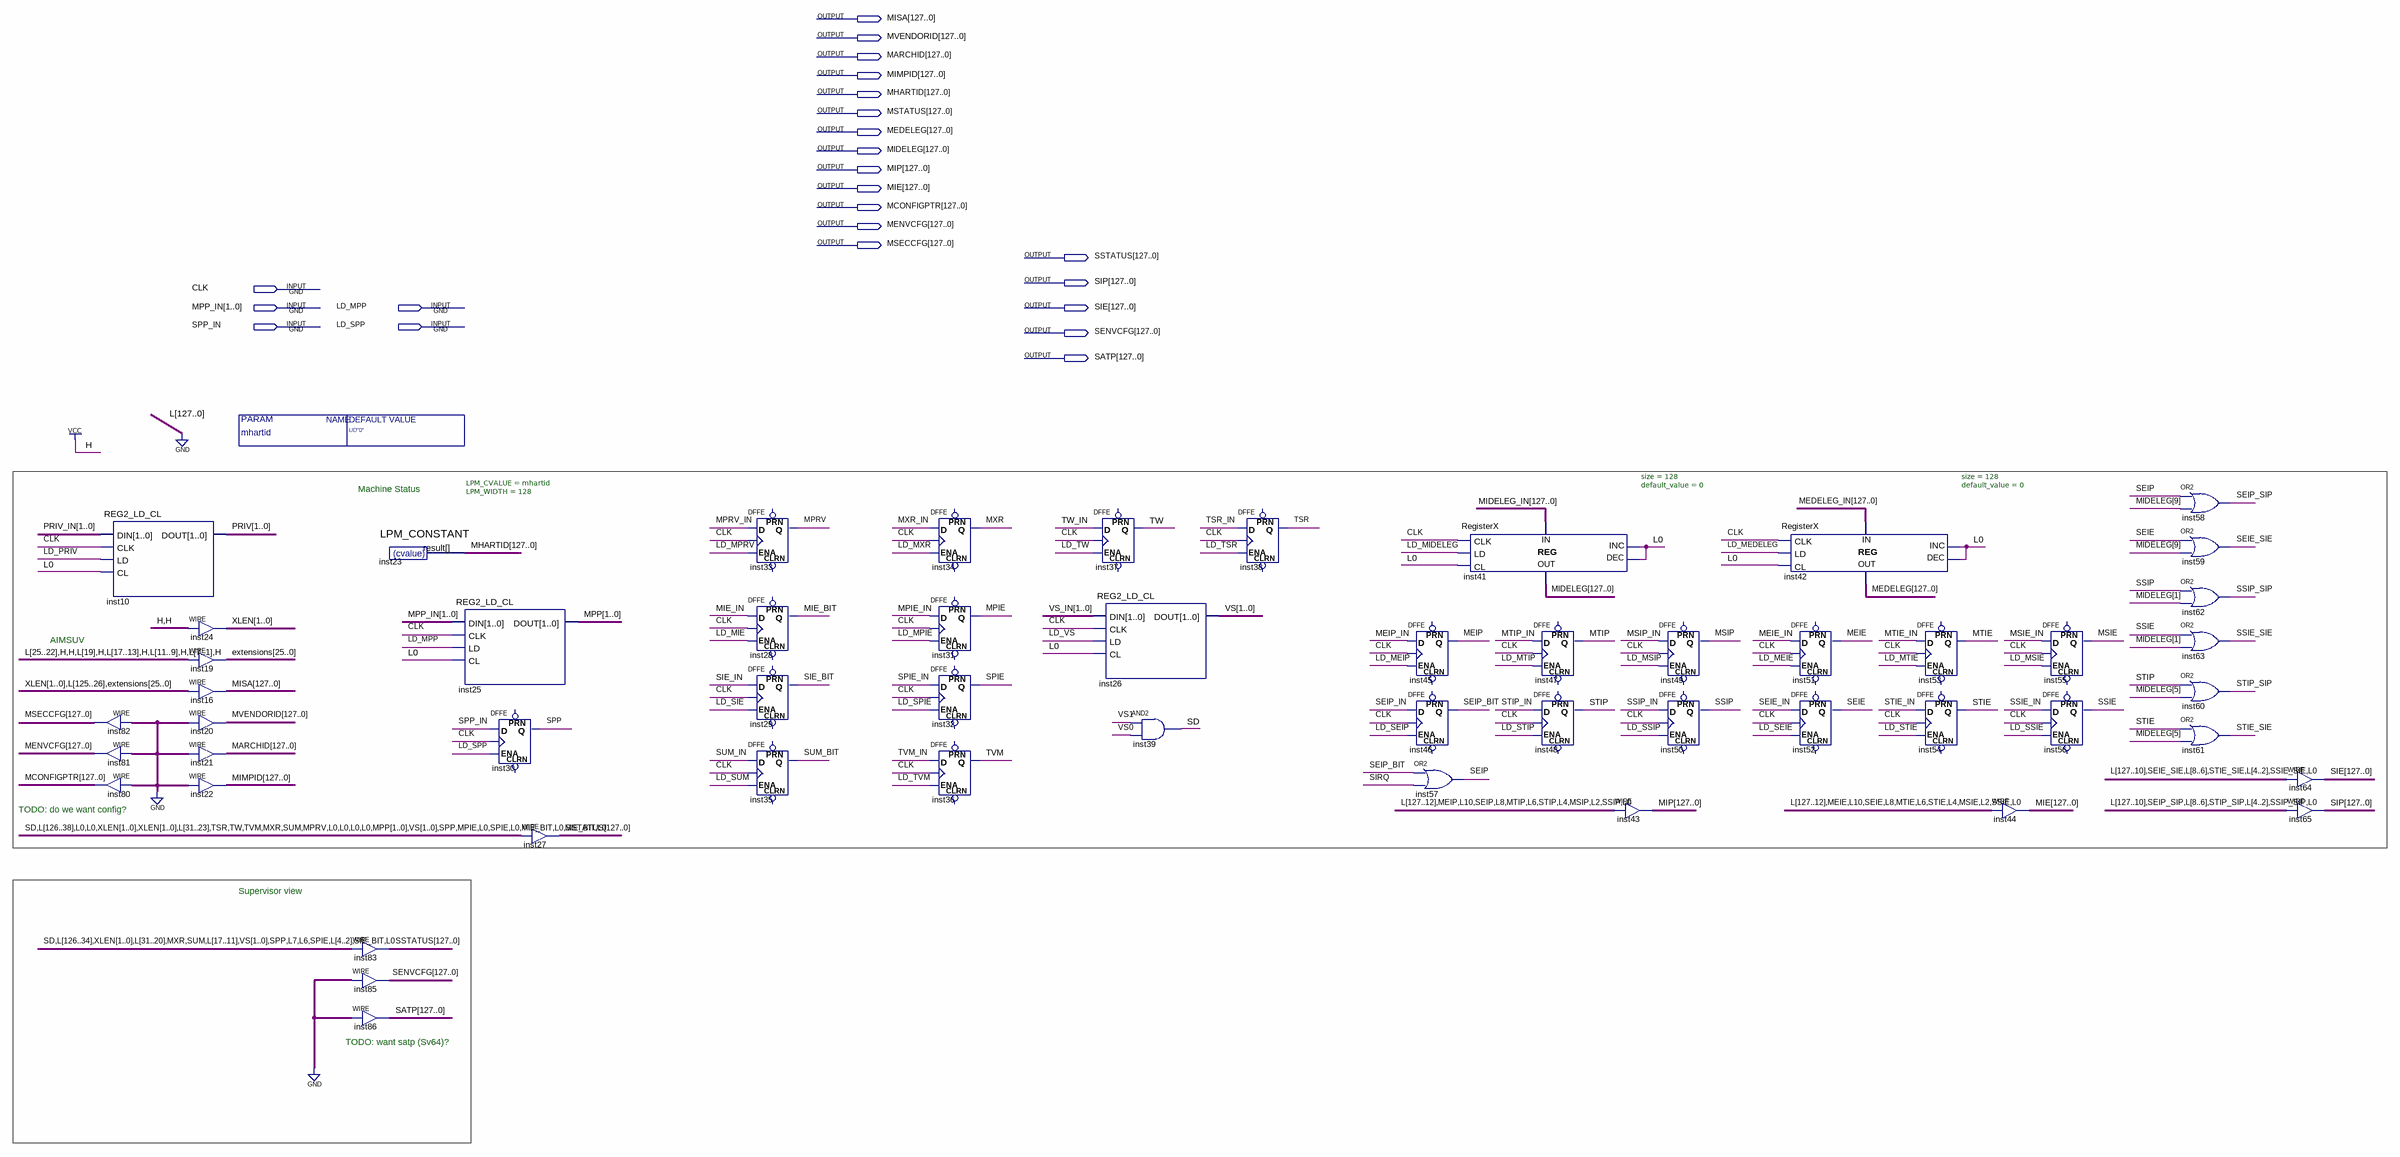
[diagram p0: schematic sheet]
// Quartus schematic Core_Status.bdf as structural Verilog: 54 symbols, 23 pins
module Core_Status #(parameter mhartid = "UD\"0\"") (
  input  CLK,
  input  [1:0] MPP_IN,
  input  LD_MPP,
  input  SPP_IN,
  input  LD_SPP,
  output [127:0] MISA,
  output [127:0] MVENDORID,
  output [127:0] MARCHID,
  output [127:0] MIMPID,
  output [127:0] MHARTID,
  output [127:0] MSTATUS,
  output [127:0] MEDELEG,
  output [127:0] MIDELEG,
  output [127:0] MIP,
  output [127:0] MIE,
  output [127:0] MCONFIGPTR,
  output [127:0] MENVCFG,
  output [127:0] MSECCFG,
  output [127:0] SSTATUS,
  output [127:0] SIP,
  output [127:0] SIE,
  output [127:0] SENVCFG,
  output [127:0] SATP
);

  wire LD_MEDELEG, LD_MEIE, LD_MEIP, LD_MIDELEG, LD_MIE, LD_MPIE, LD_MPRV, LD_MSIE, LD_MSIP, LD_MTIE,
       LD_MTIP, LD_MXR, LD_PRIV, LD_SEIE, LD_SEIP, LD_SIE, LD_SPIE, LD_SSIE, LD_SSIP, LD_STIE, LD_STIP,
       LD_SUM, LD_TSR, LD_TVM, LD_TW, LD_VS, MEIE, MEIE_IN, MEIP, MEIP_IN, MIE_BIT, MIE_IN, MPIE, MPIE_IN,
       MPRV, MPRV_IN, MSIE, MSIE_IN, MSIP, MSIP_IN, MTIE, MTIE_IN, MTIP, MTIP_IN, MXR, MXR_IN, SD, SEIE,
       SEIE_IN, SEIE_SIE, SEIP, SEIP_BIT, SEIP_IN, SEIP_SIP, SIE_BIT, SIE_IN, SIRQ, SPIE, SPIE_IN, SPP, SSIE,
       SSIE_IN, SSIE_SIE, SSIP, SSIP_IN, SSIP_SIP, STIE, STIE_IN, STIE_SIE, STIP, STIP_IN, STIP_SIP, SUM,
       SUM_BIT, SUM_IN, TSR, TSR_IN, TVM, TVM_IN, TW, TW_IN;
  wire [1:0] MPP, PRIV, PRIV_IN, VS, VS_IN, XLEN;
  wire [25:0] extensions;
  wire [127:0] MEDELEG_IN, MIDELEG_IN;

  assign MSECCFG = {128{1'b0}};  // WIRE inst82
  assign MENVCFG = {128{1'b0}};  // WIRE inst81
  assign MCONFIGPTR = {128{1'b0}};  // WIRE inst80
  REG2_LD_CL inst10 (.DIN(PRIV_IN), .CLK(CLK), .LD(LD_PRIV), .CL(1'b0), .DOUT(PRIV));
  assign XLEN = 2'b11;  // WIRE inst24
  assign extensions = 26'b00001101000001000100000001;  // WIRE inst19
  assign MISA = {XLEN, {100{1'b0}}, extensions};  // WIRE inst16
  assign MVENDORID = {128{1'b0}};  // WIRE inst20
  assign MARCHID = {128{1'b0}};  // WIRE inst21
  assign MIMPID = {128{1'b0}};  // WIRE inst22
  LPM_CONSTANT #(.LPM_CVALUE(mhartid), .LPM_WIDTH(128)) inst23 (.result(MHARTID));
  assign SSTATUS = {SD, {93{1'b0}}, XLEN, {12{1'b0}}, MXR, SUM, {7{1'b0}}, VS, SPP, 2'b00, SPIE, 3'b000, SIE_BIT, 1'b0};  // WIRE inst83
  assign SENVCFG = {128{1'b0}};  // WIRE inst85
  assign SATP = {128{1'b0}};  // WIRE inst86
  REG2_LD_CL inst25 (.DIN(MPP_IN), .CLK(CLK), .LD(LD_MPP), .CL(1'b0), .DOUT(MPP));
  DFFE inst30 (.D(SPP_IN), .CLK(CLK), .ENA(LD_SPP), .Q(SPP));  // open: PRN, CLRN
  assign MSTATUS = {SD, {91{1'b0}}, XLEN, XLEN, {9{1'b0}}, TSR, TW, TVM, MXR, SUM, MPRV, 4'b0000, MPP, VS, SPP, MPIE, 1'b0, SPIE, 1'b0, MIE_BIT, 1'b0, SIE_BIT, 1'b0};  // WIRE inst27
  DFFE inst33 (.D(MPRV_IN), .CLK(CLK), .ENA(LD_MPRV), .Q(MPRV));  // open: PRN, CLRN
  DFFE inst28 (.D(MIE_IN), .CLK(CLK), .ENA(LD_MIE), .Q(MIE_BIT));  // open: PRN, CLRN
  DFFE inst29 (.D(SIE_IN), .CLK(CLK), .ENA(LD_SIE), .Q(SIE_BIT));  // open: PRN, CLRN
  DFFE inst35 (.D(SUM_IN), .CLK(CLK), .ENA(LD_SUM), .Q(SUM_BIT));  // open: PRN, CLRN
  DFFE inst34 (.D(MXR_IN), .CLK(CLK), .ENA(LD_MXR), .Q(MXR));  // open: PRN, CLRN
  DFFE inst31 (.D(MPIE_IN), .CLK(CLK), .ENA(LD_MPIE), .Q(MPIE));  // open: PRN, CLRN
  DFFE inst32 (.D(SPIE_IN), .CLK(CLK), .ENA(LD_SPIE), .Q(SPIE));  // open: PRN, CLRN
  DFFE inst36 (.D(TVM_IN), .CLK(CLK), .ENA(LD_TVM), .Q(TVM));  // open: PRN, CLRN
  DFFE inst37 (.D(TW_IN), .CLK(CLK), .ENA(LD_TW), .Q(TW));  // open: PRN, CLRN
  REG2_LD_CL inst26 (.DIN(VS_IN), .CLK(CLK), .LD(LD_VS), .CL(1'b0), .DOUT(VS));
  and inst39 (SD, VS[1], VS[0]);
  DFFE inst38 (.D(TSR_IN), .CLK(CLK), .ENA(LD_TSR), .Q(TSR));  // open: PRN, CLRN
  DFFE inst45 (.D(MEIP_IN), .CLK(CLK), .ENA(LD_MEIP), .Q(MEIP));  // open: PRN, CLRN
  DFFE inst46 (.D(SEIP_IN), .CLK(CLK), .ENA(LD_SEIP), .Q(SEIP_BIT));  // open: PRN, CLRN
  or inst57 (SEIP, SEIP_BIT, SIRQ);
  RegisterX #(.size(128), .default_value(0)) inst41 (
    .CLK(CLK), .LD(LD_MIDELEG), .CL(1'b0), .INC(1'b0), .DEC(1'b0), .DATA_IN(MIDELEG_IN), .DATA_OUT(MIDELEG));
  DFFE inst47 (.D(MTIP_IN), .CLK(CLK), .ENA(LD_MTIP), .Q(MTIP));  // open: PRN, CLRN
  DFFE inst48 (.D(STIP_IN), .CLK(CLK), .ENA(LD_STIP), .Q(STIP));  // open: PRN, CLRN
  assign MIP = {{116{1'b0}}, MEIP, 1'b0, SEIP, 1'b0, MTIP, 1'b0, STIP, 1'b0, MSIP, 1'b0, SSIP, 1'b0};  // WIRE inst43
  DFFE inst49 (.D(MSIP_IN), .CLK(CLK), .ENA(LD_MSIP), .Q(MSIP));  // open: PRN, CLRN
  DFFE inst50 (.D(SSIP_IN), .CLK(CLK), .ENA(LD_SSIP), .Q(SSIP));  // open: PRN, CLRN
  RegisterX #(.size(128), .default_value(0)) inst42 (
    .CLK(CLK), .LD(LD_MEDELEG), .CL(1'b0), .INC(1'b0), .DEC(1'b0), .DATA_IN(MEDELEG_IN), .DATA_OUT(MEDELEG));
  DFFE inst51 (.D(MEIE_IN), .CLK(CLK), .ENA(LD_MEIE), .Q(MEIE));  // open: PRN, CLRN
  DFFE inst52 (.D(SEIE_IN), .CLK(CLK), .ENA(LD_SEIE), .Q(SEIE));  // open: PRN, CLRN
  DFFE inst53 (.D(MTIE_IN), .CLK(CLK), .ENA(LD_MTIE), .Q(MTIE));  // open: PRN, CLRN
  DFFE inst54 (.D(STIE_IN), .CLK(CLK), .ENA(LD_STIE), .Q(STIE));  // open: PRN, CLRN
  assign MIE = {{116{1'b0}}, MEIE, 1'b0, SEIE, 1'b0, MTIE, 1'b0, STIE, 1'b0, MSIE, 1'b0, SSIE, 1'b0};  // WIRE inst44
  DFFE inst55 (.D(MSIE_IN), .CLK(CLK), .ENA(LD_MSIE), .Q(MSIE));  // open: PRN, CLRN
  DFFE inst56 (.D(SSIE_IN), .CLK(CLK), .ENA(LD_SSIE), .Q(SSIE));  // open: PRN, CLRN
  or inst58 (SEIP_SIP, SEIP, MIDELEG[9]);
  or inst59 (SEIE_SIE, SEIE, MIDELEG[9]);
  or inst62 (SSIP_SIP, SSIP, MIDELEG[1]);
  or inst63 (SSIE_SIE, SSIE, MIDELEG[1]);
  or inst60 (STIP_SIP, STIP, MIDELEG[5]);
  or inst61 (STIE_SIE, STIE, MIDELEG[5]);
  assign SIE = {{118{1'b0}}, SEIE_SIE, 3'b000, STIE_SIE, 3'b000, SSIE_SIE, 1'b0};  // WIRE inst64
  assign SIP = {{118{1'b0}}, SEIP_SIP, 3'b000, STIP_SIP, 3'b000, SSIP_SIP, 1'b0};  // WIRE inst65

  // Notes on the sheet:
  //   Machine Status
  //   AIMSUV
  //   TODO: do we want config?
  //   Supervisor view
  //   TODO: want satp (Sv64)?
endmodule
